# Altium schematic sheet PROTOTYPE_G431_4IN1_v1.0.SCHDOC: Exuav BLS 32BIT ESC
size 660 x 393 mm
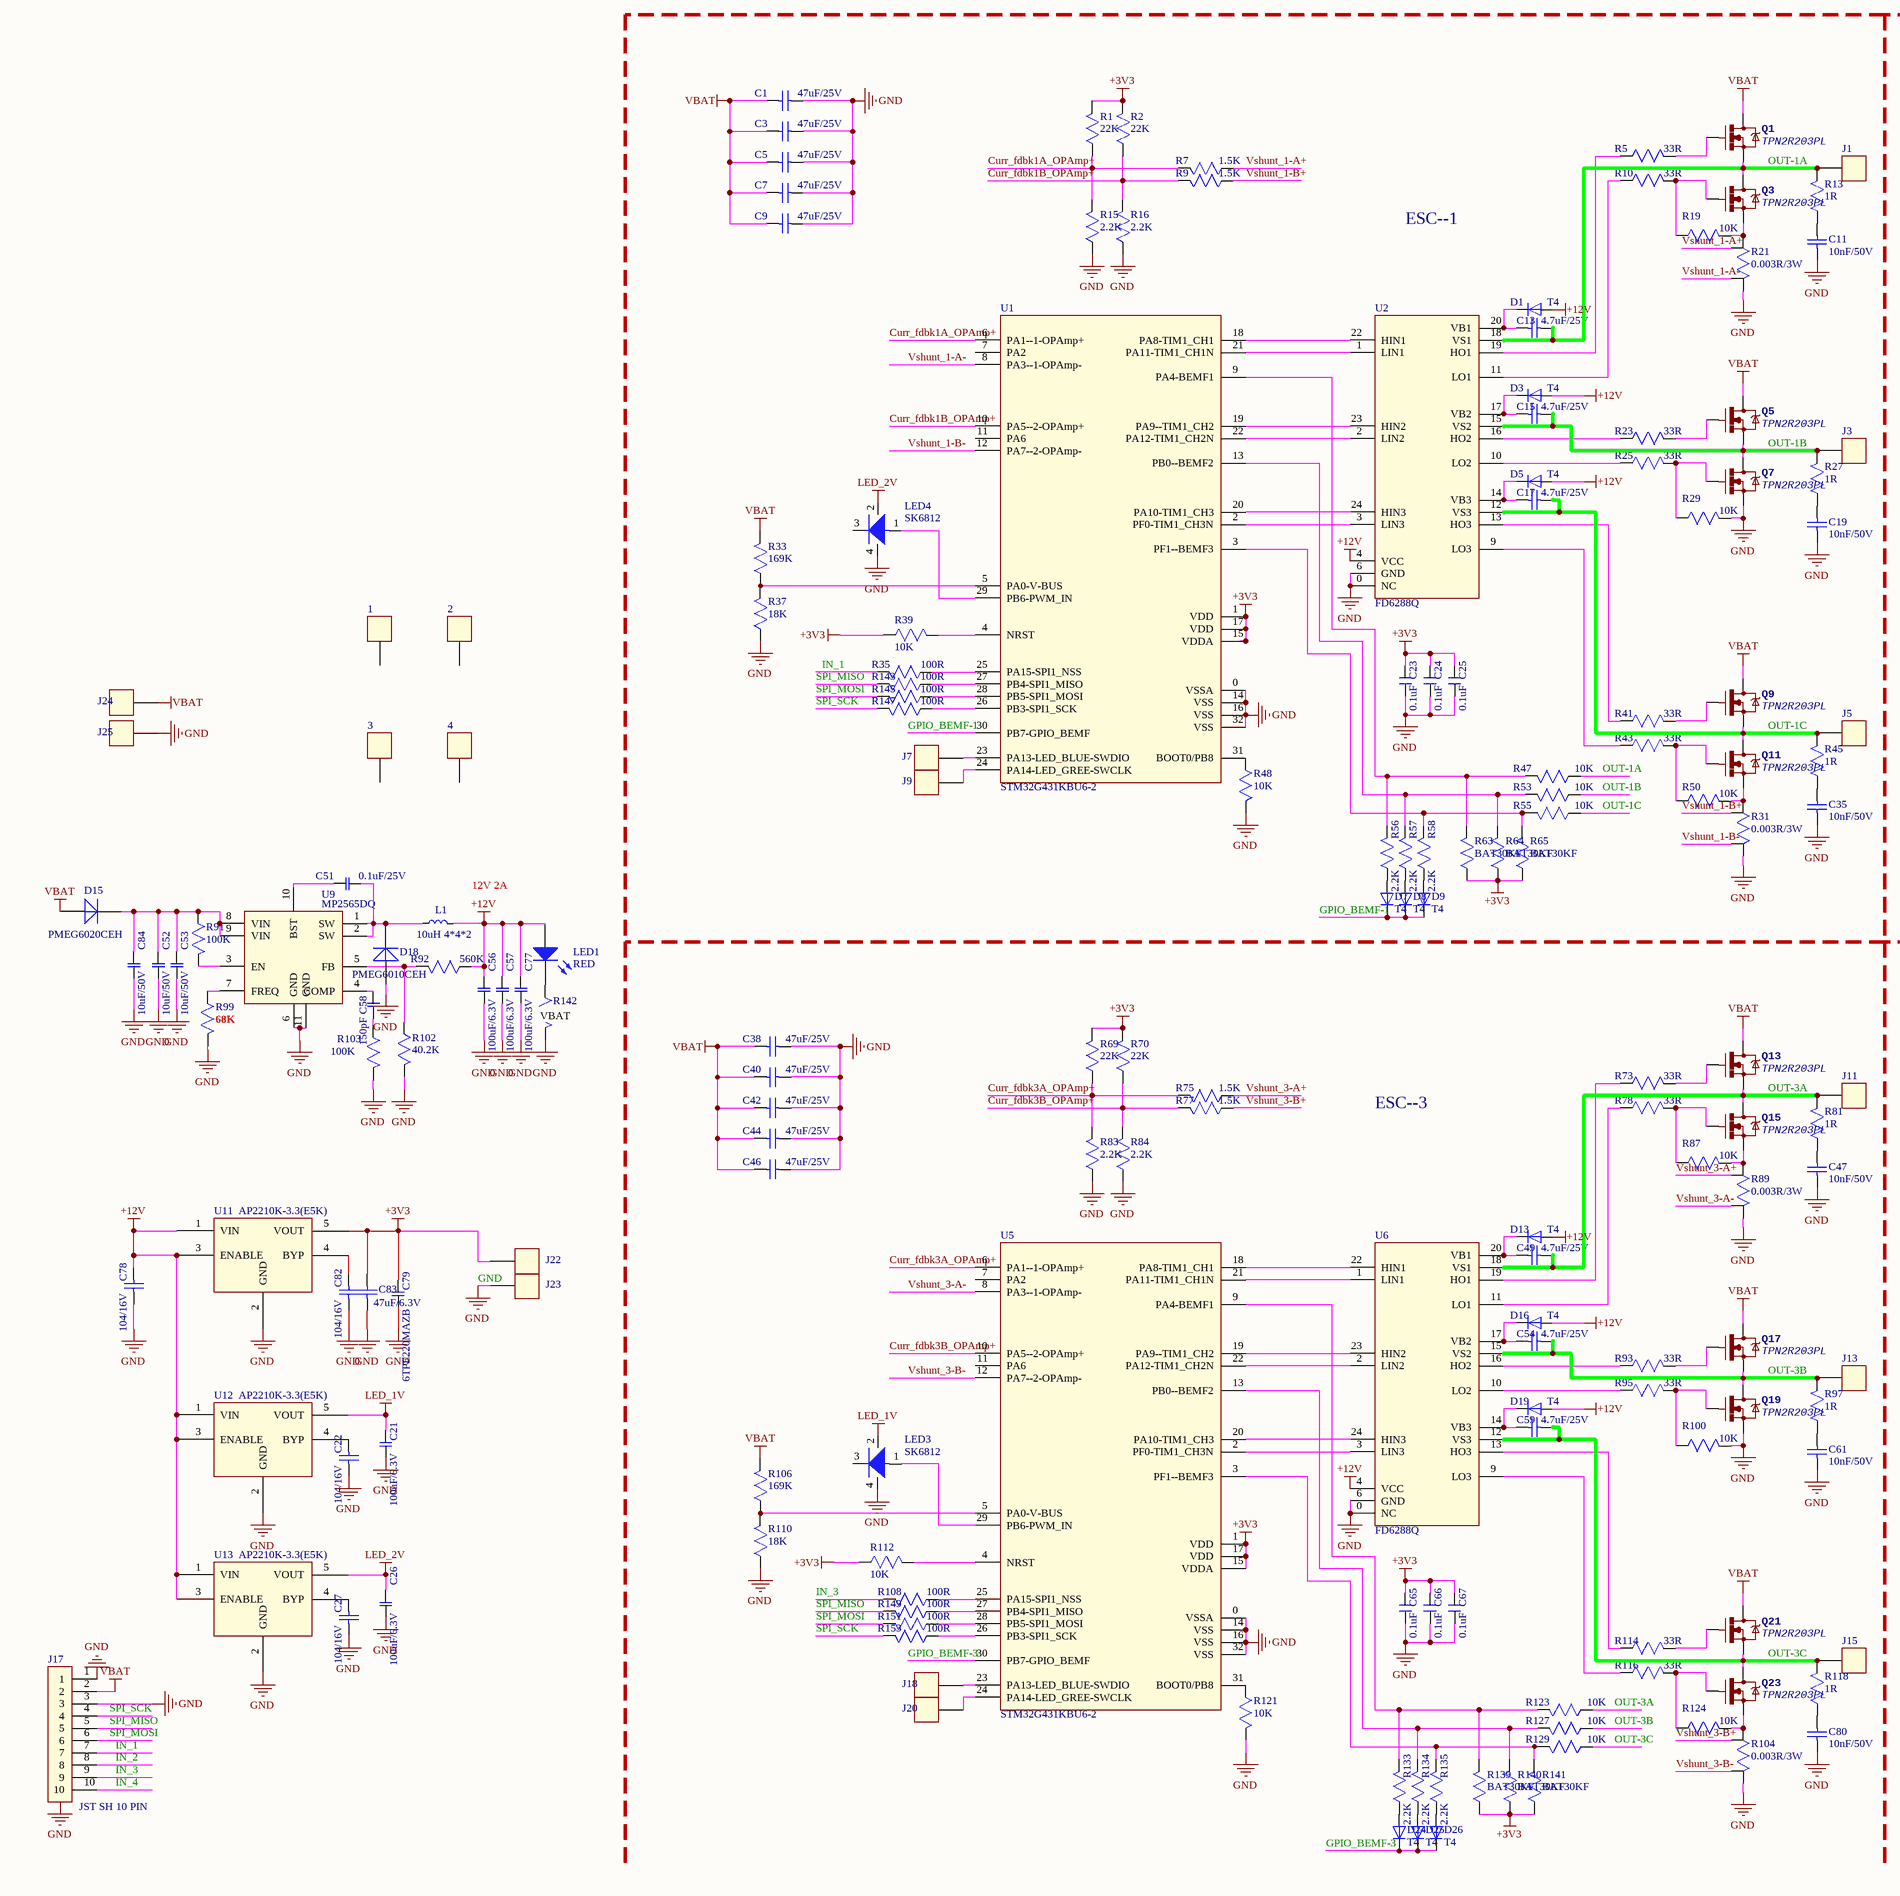
[diagram p0: PROTOTYPE_G431_4IN1_v1.0.SCHDOC, left]
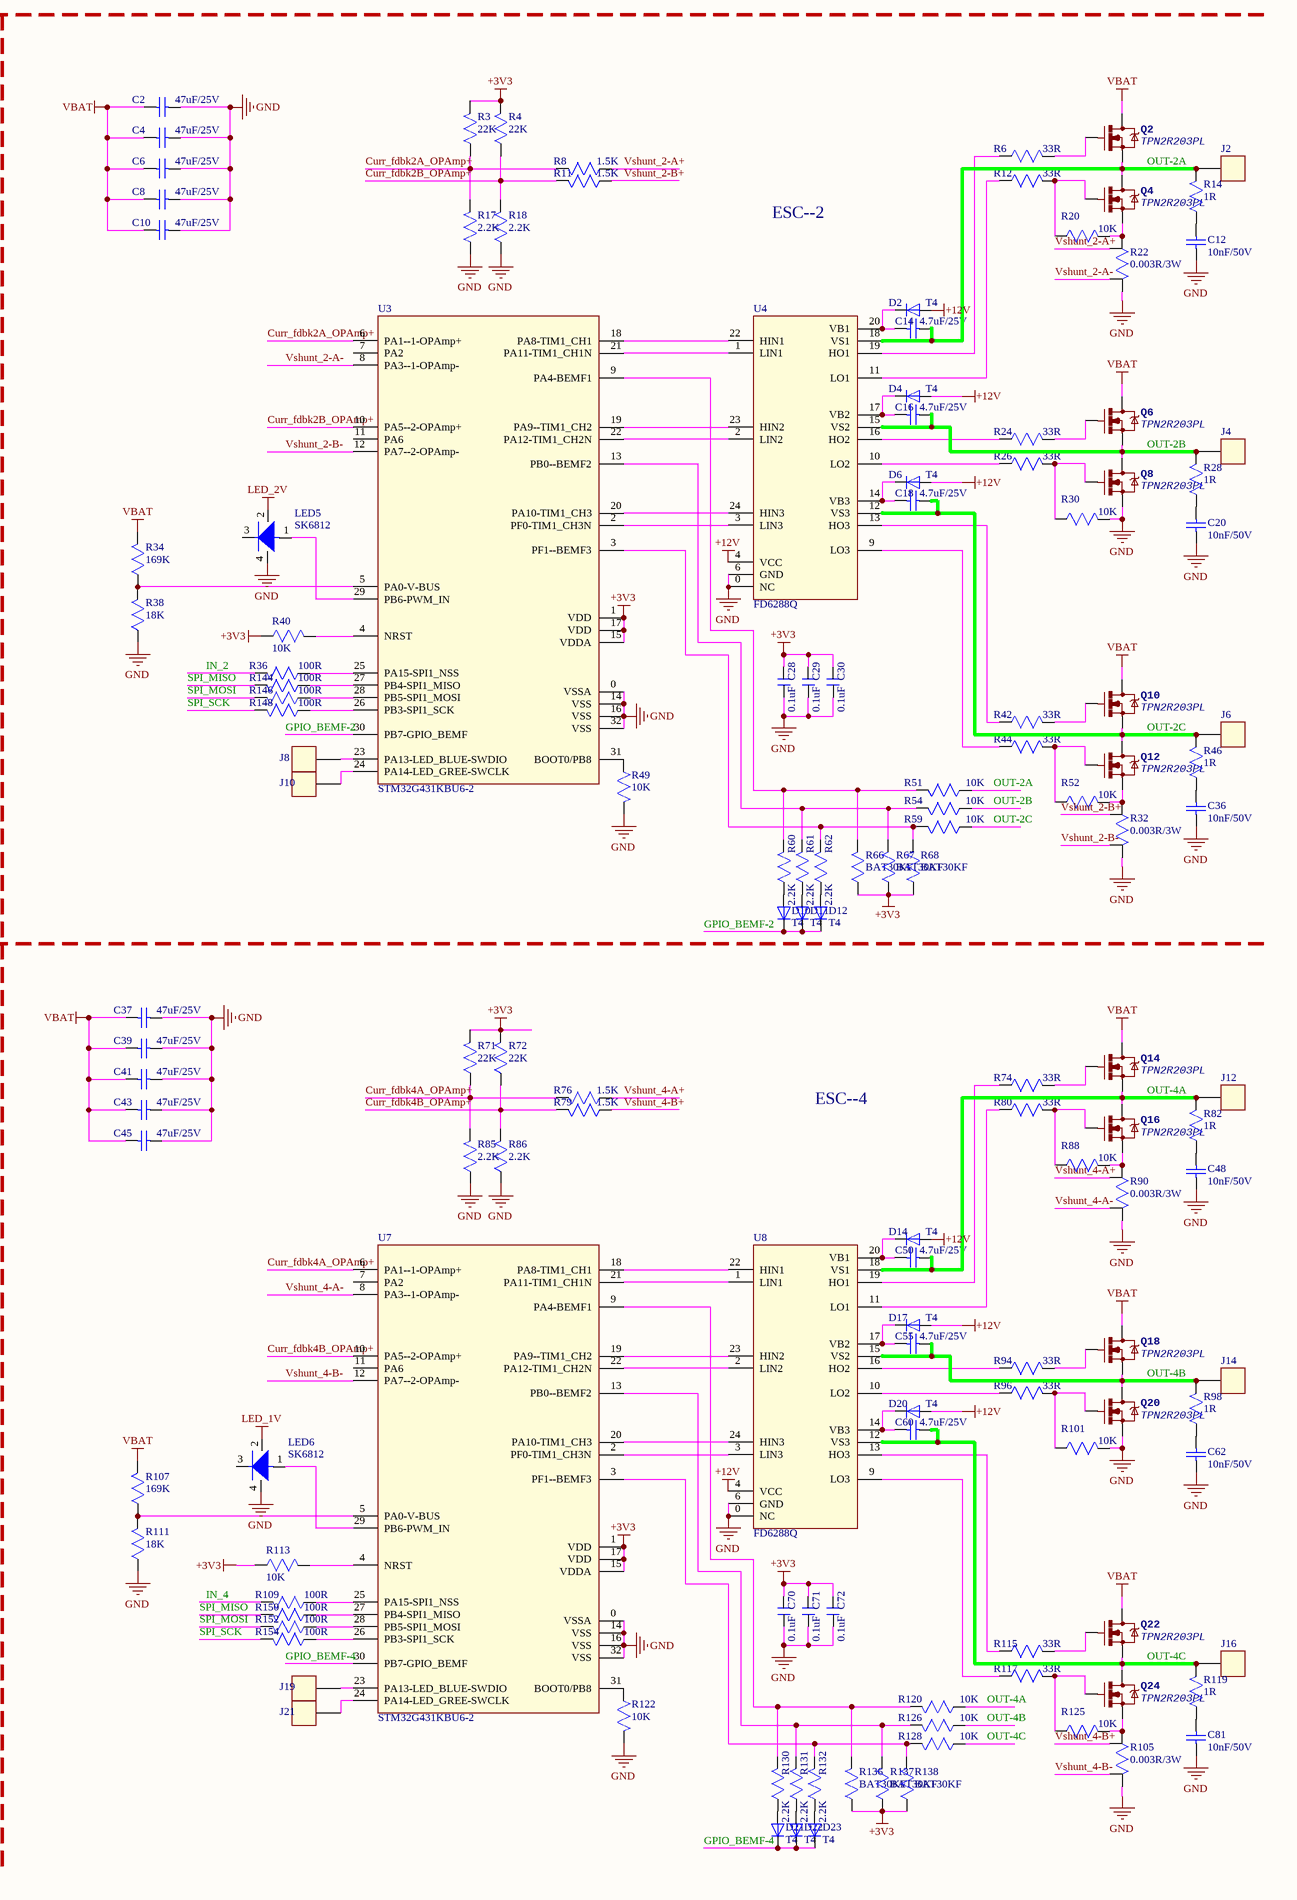
[diagram p1: PROTOTYPE_G431_4IN1_v1.0.SCHDOC, right]

## Parts
1  (no value)  [PAD-0.1]
2  (no value)  [PAD-0.1]
3  (no value)  [PAD-0.1]
4  (no value)  [PAD-0.1]
C1  47uF/25V  [1206-RES]
C2  47uF/25V  [1206-RES]
C3  47uF/25V  [1206-RES]
C4  47uF/25V  [1206-RES]
C5  47uF/25V  [1206-RES]
C6  47uF/25V  [1206-RES]
C7  47uF/25V  [1206-RES]
C8  47uF/25V  [1206-RES]
C9  47uF/25V  [1206-RES]
C10  47uF/25V  [1206-RES]
C11  10nF/50V  [0402-RES]
C12  10nF/50V  [0402-RES]
C13  4.7uF/25V  [0603-RES]
C14  4.7uF/25V  [0603-RES]
C15  4.7uF/25V  [0603-RES]
C16  4.7uF/25V  [0603-RES]
C17  4.7uF/25V  [0603-RES]
C18  4.7uF/25V  [0603-RES]
C19  10nF/50V  [0402-RES]
C20  10nF/50V  [0402-RES]
C21  100uF/6.3V  [1206-RES]
C22  104/16V  [0402-RES]
C23  0.1uF  [0402-RES]
C24  0.1uF  [0402-RES]
C25  0.1uF  [0402-RES]
C26  100uF/6.3V  [1206-RES]
C27  104/16V  [0402-RES]
C28  0.1uF  [0402-RES]
C29  0.1uF  [0402-RES]
C30  0.1uF  [0402-RES]
C35  10nF/50V  [0402-RES]
C36  10nF/50V  [0402-RES]
C37  47uF/25V  [1206-RES]
C38  47uF/25V  [1206-RES]
C39  47uF/25V  [1206-RES]
C40  47uF/25V  [1206-RES]
C41  47uF/25V  [1206-RES]
C42  47uF/25V  [1206-RES]
C43  47uF/25V  [1206-RES]
C44  47uF/25V  [1206-RES]
C45  47uF/25V  [1206-RES]
C46  47uF/25V  [1206-RES]
C47  10nF/50V  [0402-RES]
C48  10nF/50V  [0402-RES]
C49  4.7uF/25V  [0603-RES]
C50  4.7uF/25V  [0603-RES]
C51  0.1uF/25V  [0402-RES]
C52  10uF/50V  [1206-RES]
C53  10uF/50V  [1206-RES]
C54  4.7uF/25V  [0603-RES]
C55  4.7uF/25V  [0603-RES]
C56  100uF/6.3V  [1206-RES]
C57  100uF/6.3V  [1206-RES]
C58  150pF  [0402-RES]
C59  4.7uF/25V  [0603-RES]
C60  4.7uF/25V  [0603-RES]
C61  10nF/50V  [0402-RES]
C62  10nF/50V  [0402-RES]
C65  0.1uF  [0402-RES]
C66  0.1uF  [0402-RES]
C67  0.1uF  [0402-RES]
C70  0.1uF  [0402-RES]
C71  0.1uF  [0402-RES]
C72  0.1uF  [0402-RES]
C77  100uF/6.3V  [1206-RES]
C78  104/16V  [0402-RES]
C79  6TPE220MAZB  [3528-CAP]
C80  10nF/50V  [0402-RES]
C81  10nF/50V  [0402-RES]
C82  104/16V  [0402-RES]
C83  47uF/6.3V  [0805-RES]
C84  10uF/50V  [1206-RES]
D1  T4  [SOD523]
D2  T4  [SOD523]
D3  T4  [SOD523]
D4  T4  [SOD523]
D5  T4  [SOD523]
D6  T4  [SOD523]
D7  T4  [SOD-723]
D8  T4  [SOD-723]
D9  T4  [SOD-723]
D10  T4  [SOD-723]
D11  T4  [SOD-723]
D12  T4  [SOD-723]
D13  T4  [SOD523]
D14  T4  [SOD523]
D15  PMEG6020CEH  [SOD123W]
D16  T4  [SOD523]
D17  T4  [SOD523]
D18  PMEG6010CEH  [SOD123W]
D19  T4  [SOD523]
D20  T4  [SOD523]
D21  T4  [SOD-723]
D22  T4  [SOD-723]
D23  T4  [SOD-723]
D24  T4  [SOD-723]
D25  T4  [SOD-723]
D26  T4  [SOD-723]
J1  (no value)  [PAD-1  4*3]
J2  (no value)  [PAD-1  4*3]
J3  (no value)  [PAD-1  4*3]
J4  (no value)  [PAD-1  4*3]
J5  (no value)  [PAD-1  4*3]
J6  (no value)  [PAD-1  4*3]
J7  (no value)  [PAD-1  1*1.5]
J8  (no value)  [PAD-1  1*1.5]
J9  (no value)  [PAD-1  1*1.5]
J10  (no value)  [PAD-1  1*1.5]
J11  (no value)  [PAD-1  4*3]
J12  (no value)  [PAD-1  4*3]
J13  (no value)  [PAD-1  4*3]
J14  (no value)  [PAD-1  4*3]
J15  (no value)  [PAD-1  4*3]
J16  (no value)  [PAD-1  4*3]
J17  JST SH 10 PIN  [JST SH 10 PIN]
J18  (no value)  [PAD-1  1*1.5]
J19  (no value)  [PAD-1  1*1.5]
J20  (no value)  [PAD-1  1*1.5]
J21  (no value)  [PAD-1  1*1.5]
J22  (no value)  [PAD-1  1*1.5]
J23  (no value)  [PAD-1  1*1.5]
J24  (no value)  [PAD-1  1*1.5]
J25  (no value)  [PAD-1  1*1.5]
L1  10uH 4*4*2  [LPS4018]
LED1  RED  [0402-LED]
LED3  SK6812  [SK6812]
LED4  SK6812  [SK6812]
LED5  SK6812  [SK6812]
LED6  SK6812  [SK6812]
Q1  TPN2R203PL  [DFN8]
Q2  TPN2R203PL  [DFN8]
Q3  TPN2R203PL  [DFN8]
Q4  TPN2R203PL  [DFN8]
Q5  TPN2R203PL  [DFN8]
Q6  TPN2R203PL  [DFN8]
Q7  TPN2R203PL  [DFN8]
Q8  TPN2R203PL  [DFN8]
Q9  TPN2R203PL  [DFN8]
Q10  TPN2R203PL  [DFN8]
Q11  TPN2R203PL  [DFN8]
Q12  TPN2R203PL  [DFN8]
Q13  TPN2R203PL  [DFN8]
Q14  TPN2R203PL  [DFN8]
Q15  TPN2R203PL  [DFN8]
Q16  TPN2R203PL  [DFN8]
Q17  TPN2R203PL  [DFN8]
Q18  TPN2R203PL  [DFN8]
Q19  TPN2R203PL  [DFN8]
Q20  TPN2R203PL  [DFN8]
Q21  TPN2R203PL  [DFN8]
Q22  TPN2R203PL  [DFN8]
Q23  TPN2R203PL  [DFN8]
Q24  TPN2R203PL  [DFN8]
R1  22K  [0402-RES]
R2  22K  [0402-RES]
R3  22K  [0402-RES]
R4  22K  [0402-RES]
R5  33R  [0402-RES]
R6  33R  [0402-RES]
R7  1.5K  [0402-RES]
R8  1.5K  [0402-RES]
R9  1.5K  [0402-RES]
R10  33R  [0402-RES]
R11  1.5K  [0402-RES]
R12  33R  [0402-RES]
R13  1R  [0402-RES]
R14  1R  [0402-RES]
R15  2.2K  [0402-RES]
R16  2.2K  [0402-RES]
R17  2.2K  [0402-RES]
R18  2.2K  [0402-RES]
R19  10K  [0402-RES]
R20  10K  [0402-RES]
R21  0.003R/3W  [2010-RES]
R22  0.003R/3W  [2010-RES]
R23  33R  [0402-RES]
R24  33R  [0402-RES]
R25  33R  [0402-RES]
R26  33R  [0402-RES]
R27  1R  [0402-RES]
R28  1R  [0402-RES]
R29  10K  [0402-RES]
R30  10K  [0402-RES]
R31  0.003R/3W  [2010-RES]
R32  0.003R/3W  [2010-RES]
R33  169K  [0402-RES]
R34  169K  [0402-RES]
R35  100R  [0402-RES]
R36  100R  [0402-RES]
R37  18K  [0402-RES]
R38  18K  [0402-RES]
R39  10K  [0402-RES]
R40  10K  [0402-RES]
R41  33R  [0402-RES]
R42  33R  [0402-RES]
R43  33R  [0402-RES]
R44  33R  [0402-RES]
R45  1R  [0402-RES]
R46  1R  [0402-RES]
R47  10K  [0402-RES]
R48  10K  [0402-RES]
R49  10K  [0402-RES]
R50  10K  [0402-RES]
R51  10K  [0402-RES]
R52  10K  [0402-RES]
R53  10K  [0402-RES]
R54  10K  [0402-RES]
R55  10K  [0402-RES]
R56  2.2K  [0402-RES]
R57  2.2K  [0402-RES]
R58  2.2K  [0402-RES]
R59  10K  [0402-RES]
R60  2.2K  [0402-RES]
R61  2.2K  [0402-RES]
R62  2.2K  [0402-RES]
R63  BAT30KF  [0402-RES]
R64  BAT30KF  [0402-RES]
R65  BAT30KF  [0402-RES]
R66  BAT30KF  [0402-RES]
R67  BAT30KF  [0402-RES]
R68  BAT30KF  [0402-RES]
R69  22K  [0402-RES]
R70  22K  [0402-RES]
R71  22K  [0402-RES]
R72  22K  [0402-RES]
R73  33R  [0402-RES]
R74  33R  [0402-RES]
R75  1.5K  [0402-RES]
R76  1.5K  [0402-RES]
R77  1.5K  [0402-RES]
R78  33R  [0402-RES]
R79  1.5K  [0402-RES]
R80  33R  [0402-RES]
R81  1R  [0402-RES]
R82  1R  [0402-RES]
R83  2.2K  [0402-RES]
R84  2.2K  [0402-RES]
R85  2.2K  [0402-RES]
R86  2.2K  [0402-RES]
R87  10K  [0402-RES]
R88  10K  [0402-RES]
R89  0.003R/3W  [2010-RES]
R90  0.003R/3W  [2010-RES]
R91  100K  [0402-RES]
R92  560K  [0402-RES]
R93  33R  [0402-RES]
R94  33R  [0402-RES]
R95  33R  [0402-RES]
R96  33R  [0402-RES]
R97  1R  [0402-RES]
R98  1R  [0402-RES]
R99  68K  [0402-RES]
R100  10K  [0402-RES]
R101  10K  [0402-RES]
R102  40.2K  [0402-RES]
R103  100K  [0402-RES]
R104  0.003R/3W  [2010-RES]
R105  0.003R/3W  [2010-RES]
R106  169K  [0402-RES]
R107  169K  [0402-RES]
R108  100R  [0402-RES]
R109  100R  [0402-RES]
R110  18K  [0402-RES]
R111  18K  [0402-RES]
R112  10K  [0402-RES]
R113  10K  [0402-RES]
R114  33R  [0402-RES]
R115  33R  [0402-RES]
R116  33R  [0402-RES]
R117  33R  [0402-RES]
R118  1R  [0402-RES]
R119  1R  [0402-RES]
R120  10K  [0402-RES]
R121  10K  [0402-RES]
R122  10K  [0402-RES]
R123  10K  [0402-RES]
R124  10K  [0402-RES]
R125  10K  [0402-RES]
R126  10K  [0402-RES]
R127  10K  [0402-RES]
R128  10K  [0402-RES]
R129  10K  [0402-RES]
R130  2.2K  [0402-RES]
R131  2.2K  [0402-RES]
R132  2.2K  [0402-RES]
R133  2.2K  [0402-RES]
R134  2.2K  [0402-RES]
R135  2.2K  [0402-RES]
R136  BAT30KF  [0402-RES]
R137  BAT30KF  [0402-RES]
R138  BAT30KF  [0402-RES]
R139  BAT30KF  [0402-RES]
R140  BAT30KF  [0402-RES]
R141  BAT30KF  [0402-RES]
R142  1K  [0402-RES]
R143  100R  [0402-RES]
R144  100R  [0402-RES]
R145  100R  [0402-RES]
R146  100R  [0402-RES]
R147  100R  [0402-RES]
R148  100R  [0402-RES]
R149  100R  [0402-RES]
R150  100R  [0402-RES]
R151  100R  [0402-RES]
R152  100R  [0402-RES]
R153  100R  [0402-RES]
R154  100R  [0402-RES]
U1  STM32G431KBU6-2  [UFQFPN32]
U2  FD6288Q  [QFN24]
U3  STM32G431KBU6-2  [UFQFPN32]
U4  FD6288Q  [QFN24]
U5  STM32G431KBU6-2  [UFQFPN32]
U6  FD6288Q  [QFN24]
U7  STM32G431KBU6-2  [UFQFPN32]
U8  FD6288Q  [QFN24]
U9  MP2565DQ  [QFN10]
U11  AP2210K-3.3(E5K)  [SOT23-5]
U12  AP2210K-3.3(E5K)  [SOT23-5]
U13  AP2210K-3.3(E5K)  [SOT23-5]

## Nets
+3V3: C23.2 C24.2 C25.2 C28.2 C29.2 C30.2 C65.2 C66.2 C67.2 C70.2 C71.2 C72.2 C79.1 C83.2 J22.1 R1.2 R2.2 R3.2 R4.2 R39.1 R40.1 R63.1 R64.1 R65.1 R66.1 R67.1 R68.1 R69.2 R70.2 R71.2 R72.2 R112.1 R113.1 R136.1 R137.1 R138.1 R139.1 R140.1 R141.1 U1.1(VDD) U1.15(VDDA) U1.17(VDD) U3.1(VDD) U3.15(VDDA) U3.17(VDD) U5.1(VDD) U5.15(VDDA) U5.17(VDD) U7.1(VDD) U7.15(VDDA) U7.17(VDD) U11.5(VOUT)
+12V: C56.1 C57.1 C77.1 C78.2 D1.2 D2.2 D3.2 D4.2 D5.2 D6.2 D13.2 D14.2 D16.2 D17.2 D19.2 D20.2 L1.1 LED1.1 R92.1 U2.4(VCC) U4.4(VCC) U6.4(VCC) U8.4(VCC) U11.1(VIN) U11.3(ENABLE) U12.1(VIN) U12.3(ENABLE) U13.1(VIN) U13.3(ENABLE)
GND: C1.2 C2.2 C3.2 C4.2 C5.2 C6.2 C7.2 C8.2 C9.2 C10.2 C11.2 C12.2 C19.2 C20.2 C21.2 C22.1 C23.1 C24.1 C25.1 C26.2 C27.1 C28.1 C29.1 C30.1 C35.2 C36.2 C37.2 C38.2 C39.2 C40.2 C41.2 C42.2 C43.2 C44.2 C45.2 C46.2 C47.2 C48.2 C52.2 C53.2 C56.2 C57.2 C61.2 C62.2 C65.1 C66.1 C67.1 C70.1 C71.1 C72.1 C77.2 C78.1 C79.2 C80.2 C81.2 C82.1 C83.1 C84.2 D18.2(CATHODE) J17.0(GND) J17.1 J17.3 J23.1 J25.1 LED3.4(GND) LED4.4(GND) LED5.4(GND) LED6.4(GND) Q7.3(S) Q8.3(S) Q19.3(S) Q20.3(S) R15.1 R16.1 R17.1 R18.1 R21.2 R22.2 R29.2 R30.2 R31.2 R32.2 R37.1 R38.1 R48.2 R49.2 R83.1 R84.1 R85.1 R86.1 R89.2 R90.2 R99.2 R100.2 R101.2 R102.2 R103.2 R104.2 R105.2 R110.1 R111.1 R121.2 R122.2 R142.2 U1.0(VSSA) U1.14(VSS) U1.16(VSS) U1.32(VSS) U2.0(NC) U2.6(GND) U3.0(VSSA) U3.14(VSS) U3.16(VSS) U3.32(VSS) U4.0(NC) U4.6(GND) U5.0(VSSA) U5.14(VSS) U5.16(VSS) U5.32(VSS) U6.0(NC) U6.6(GND) U7.0(VSSA) U7.14(VSS) U7.16(VSS) U7.32(VSS) U8.0(NC) U8.6(GND) U9.6(GND) U9.11(GND) U11.2(GND) U12.2(GND) U13.2(GND)
LED_1V: C21.1 LED3.2(VDD) LED6.2(VDD) U12.5(VOUT)
LED_2V: C26.1 LED4.2(VDD) LED5.2(VDD) U13.5(VOUT)
VBAT: C1.1 C2.1 C3.1 C4.1 C5.1 C6.1 C7.1 C8.1 C9.1 C10.1 C37.1 C38.1 C39.1 C40.1 C41.1 C42.1 C43.1 C44.1 C45.1 C46.1 D15.2(CATHODE) J17.2 J24.1 Q1.5(D) Q2.5(D) Q5.5(D) Q6.5(D) Q9.5(D) Q10.5(D) Q13.5(D) Q14.5(D) Q17.5(D) Q18.5(D) Q21.5(D) Q22.5(D) R33.2 R34.2 R106.2 R107.2
Curr_fdbk1A_OPAmp+: R1.1 R7.2 R15.2 U1.6(PA1--1-OPAmp+)
Curr_fdbk1B_OPAmp+: R2.1 R9.2 R16.2 U1.10(PA5--2-OPAmp+)
Curr_fdbk2A_OPAmp+: R3.1 R8.2 R17.2 U3.6(PA1--1-OPAmp+)
Curr_fdbk2B_OPAmp+: R4.1 R11.2 R18.2 U3.10(PA5--2-OPAmp+)
Curr_fdbk3A_OPAmp+: R69.1 R75.2 R83.2 U5.6(PA1--1-OPAmp+)
Curr_fdbk3B_OPAmp+: R70.1 R77.2 R84.2 U5.10(PA5--2-OPAmp+)
Curr_fdbk4A_OPAmp+: R71.1 R76.2 R85.2 U7.6(PA1--1-OPAmp+)
Curr_fdbk4B_OPAmp+: R72.1 R79.2 R86.2 U7.10(PA5--2-OPAmp+)
GPIO_BEMF-1: D7.1 D8.1 D9.1 U1.30(PB7-GPIO_BEMF)
GPIO_BEMF-2: D10.1 D11.1 D12.1 U3.30(PB7-GPIO_BEMF)
GPIO_BEMF-3: D24.1 D25.1 D26.1 U5.30(PB7-GPIO_BEMF)
GPIO_BEMF-4: D21.1 D22.1 D23.1 U7.30(PB7-GPIO_BEMF)
IN_1: J17.7 R35.2
IN_2: J17.8 R36.2
IN_3: J17.9 R108.2
IN_4: J17.10 R109.2
OUT-1A: C13.1 J1.1 Q1.3(S) Q3.5(D) R13.2 R47.1 U2.18(VS1)
OUT-1B: C15.1 J3.1 Q5.3(S) Q7.5(D) R27.2 R53.1 U2.15(VS2)
OUT-1C: C17.1 J5.1 Q9.3(S) Q11.5(D) R45.2 R55.1 U2.12(VS3)
OUT-2A: C14.1 J2.1 Q2.3(S) Q4.5(D) R14.2 R51.1 U4.18(VS1)
OUT-2B: C16.1 J4.1 Q6.3(S) Q8.5(D) R28.2 R54.1 U4.15(VS2)
OUT-2C: C18.1 J6.1 Q10.3(S) Q12.5(D) R46.2 R59.1 U4.12(VS3)
OUT-3A: C49.1 J11.1 Q13.3(S) Q15.5(D) R81.2 R123.1 U6.18(VS1)
OUT-3B: C54.1 J13.1 Q17.3(S) Q19.5(D) R97.2 R127.1 U6.15(VS2)
OUT-3C: C59.1 J15.1 Q21.3(S) Q23.5(D) R118.2 R129.1 U6.12(VS3)
OUT-4A: C50.1 J12.1 Q14.3(S) Q16.5(D) R82.2 R120.1 U8.18(VS1)
OUT-4B: C55.1 J14.1 Q18.3(S) Q20.5(D) R98.2 R126.1 U8.15(VS2)
OUT-4C: C60.1 J16.1 Q22.3(S) Q24.5(D) R119.2 R128.1 U8.12(VS3)
SPI_MISO: J17.5 R143.2 R144.2 R149.2 R150.2
SPI_MOSI: J17.6 R145.2 R146.2 R151.2 R152.2
SPI_SCK: J17.4 R147.2 R148.2 R153.2 R154.2
Vshunt_1-A+: R7.1 R21.3
Vshunt_1-A-: R21.4 U1.8(PA3--1-OPAmp-)
Vshunt_1-B+: R9.1 R31.3
Vshunt_1-B-: R31.4 U1.12(PA7--2-OPAmp-)
Vshunt_2-A+: R8.1 R22.3
Vshunt_2-A-: R22.4 U3.8(PA3--1-OPAmp-)
Vshunt_2-B+: R11.1 R32.3
Vshunt_2-B-: R32.4 U3.12(PA7--2-OPAmp-)
Vshunt_3-A+: R75.1 R89.3
Vshunt_3-A-: R89.4 U5.8(PA3--1-OPAmp-)
Vshunt_3-B+: R77.1 R104.3
Vshunt_3-B-: R104.4 U5.12(PA7--2-OPAmp-)
Vshunt_4-A+: R76.1 R90.3
Vshunt_4-A-: R90.4 U7.8(PA3--1-OPAmp-)
Vshunt_4-B+: R79.1 R105.3
Vshunt_4-B-: R105.4 U7.12(PA7--2-OPAmp-)
NetC11_1: C11.1 R13.1
NetC12_1: C12.1 R14.1
NetC13_2: C13.2 D1.1 U2.20(VB1)
NetC14_2: C14.2 D2.1 U4.20(VB1)
NetC15_2: C15.2 D3.1 U2.17(VB2)
NetC16_2: C16.2 D4.1 U4.17(VB2)
NetC17_2: C17.2 D5.1 U2.14(VB3)
NetC18_2: C18.2 D6.1 U4.14(VB3)
NetC19_1: C19.1 R27.1
NetC20_1: C20.1 R28.1
NetC22_2: C22.2 U12.4(BYP)
NetC27_2: C27.2 U13.4(BYP)
NetC35_1: C35.1 R45.1
NetC36_1: C36.1 R46.1
NetC47_1: C47.1 R81.1
NetC48_1: C48.1 R82.1
NetC49_2: C49.2 D13.1 U6.20(VB1)
NetC50_2: C50.2 D14.1 U8.20(VB1)
NetC51_1: C51.1 D18.1(ANODE) L1.2 U9.1(SW) U9.2(SW)
NetC51_2: C51.2 U9.10(BST)
NetC52_1: C52.1 C53.1 C84.1 D15.1(ANODE) R91.1 U9.8(VIN) U9.9(VIN)
NetC54_2: C54.2 D16.1 U6.17(VB2)
NetC55_2: C55.2 D17.1 U8.17(VB2)
NetC58_1: C58.1 R103.1
NetC58_2: C58.2 U9.4(COMP)
NetC59_2: C59.2 D19.1 U6.14(VB3)
NetC60_2: C60.2 D20.1 U8.14(VB3)
NetC61_1: C61.1 R97.1
NetC62_1: C62.1 R98.1
NetC80_1: C80.1 R118.1
NetC81_1: C81.1 R119.1
NetC82_2: C82.2 U11.4(BYP)
NetD7_2: D7.2 R56.1
NetD8_2: D8.2 R57.1
NetD9_2: D9.2 R58.1
NetD10_2: D10.2 R60.1
NetD11_2: D11.2 R61.1
NetD12_2: D12.2 R62.1
NetD21_2: D21.2 R130.1
NetD22_2: D22.2 R131.1
NetD23_2: D23.2 R132.1
NetD24_2: D24.2 R133.1
NetD25_2: D25.2 R134.1
NetD26_2: D26.2 R135.1
NetJ7_1: J7.1 U1.23(PA13-LED_BLUE-SWDIO)
NetJ8_1: J8.1 U3.23(PA13-LED_BLUE-SWDIO)
NetJ9_1: J9.1 U1.24(PA14-LED_GREE-SWCLK)
NetJ10_1: J10.1 U3.24(PA14-LED_GREE-SWCLK)
NetJ18_1: J18.1 U5.23(PA13-LED_BLUE-SWDIO)
NetJ19_1: J19.1 U7.23(PA13-LED_BLUE-SWDIO)
NetJ20_1: J20.1 U5.24(PA14-LED_GREE-SWCLK)
NetJ21_1: J21.1 U7.24(PA14-LED_GREE-SWCLK)
NetLED1_2: LED1.2 R142.1
NetLED3_1: LED3.1(DIN) U5.29(PB6-PWM_IN)
NetLED4_1: LED4.1(DIN) U1.29(PB6-PWM_IN)
NetLED5_1: LED5.1(DIN) U3.29(PB6-PWM_IN)
NetLED6_1: LED6.1(DIN) U7.29(PB6-PWM_IN)
NetQ1_4: Q1.4(G) R5.2
NetQ2_4: Q2.4(G) R6.2
NetQ3_3: Q3.3(S) R19.2 R21.1
NetQ3_4: Q3.4(G) R10.2 R19.1
NetQ4_3: Q4.3(S) R20.2 R22.1
NetQ4_4: Q4.4(G) R12.2 R20.1
NetQ5_4: Q5.4(G) R23.2
NetQ6_4: Q6.4(G) R24.2
NetQ7_4: Q7.4(G) R25.2 R29.1
NetQ8_4: Q8.4(G) R26.2 R30.1
NetQ9_4: Q9.4(G) R41.2
NetQ10_4: Q10.4(G) R42.2
NetQ11_3: Q11.3(S) R31.1 R50.2
NetQ11_4: Q11.4(G) R43.2 R50.1
NetQ12_3: Q12.3(S) R32.1 R52.2
NetQ12_4: Q12.4(G) R44.2 R52.1
NetQ13_4: Q13.4(G) R73.2
NetQ14_4: Q14.4(G) R74.2
NetQ15_3: Q15.3(S) R87.2 R89.1
NetQ15_4: Q15.4(G) R78.2 R87.1
NetQ16_3: Q16.3(S) R88.2 R90.1
NetQ16_4: Q16.4(G) R80.2 R88.1
NetQ17_4: Q17.4(G) R93.2
NetQ18_4: Q18.4(G) R94.2
NetQ19_4: Q19.4(G) R95.2 R100.1
NetQ20_4: Q20.4(G) R96.2 R101.1
NetQ21_4: Q21.4(G) R114.2
NetQ22_4: Q22.4(G) R115.2
NetQ23_3: Q23.3(S) R104.1 R124.2
NetQ23_4: Q23.4(G) R116.2 R124.1
NetQ24_3: Q24.3(S) R105.1 R125.2
NetQ24_4: Q24.4(G) R117.2 R125.1
NetR5_1: R5.1 U2.19(HO1)
NetR6_1: R6.1 U4.19(HO1)
NetR10_1: R10.1 U2.11(LO1)
NetR12_1: R12.1 U4.11(LO1)
NetR23_1: R23.1 U2.16(HO2)
NetR24_1: R24.1 U4.16(HO2)
NetR25_1: R25.1 U2.10(LO2)
NetR26_1: R26.1 U4.10(LO2)
NetR33_1: R33.1 R37.2 U1.5(PA0-V-BUS)
NetR34_1: R34.1 R38.2 U3.5(PA0-V-BUS)
NetR35_1: R35.1 U1.25(PA15-SPI1_NSS)
NetR36_1: R36.1 U3.25(PA15-SPI1_NSS)
NetR39_2: R39.2 U1.4(NRST)
NetR40_2: R40.2 U3.4(NRST)
NetR41_1: R41.1 U2.13(HO3)
NetR42_1: R42.1 U4.13(HO3)
NetR43_1: R43.1 U2.9(LO3)
NetR44_1: R44.1 U4.9(LO3)
NetR47_2: R47.2 R56.2 R63.2 U1.9(PA4-BEMF1)
NetR48_1: R48.1 U1.31(BOOT0/PB8)
NetR49_1: R49.1 U3.31(BOOT0/PB8)
NetR51_2: R51.2 R60.2 R66.2 U3.9(PA4-BEMF1)
NetR53_2: R53.2 R57.2 R64.2 U1.13(PB0--BEMF2)
NetR54_2: R54.2 R61.2 R67.2 U3.13(PB0--BEMF2)
NetR55_2: R55.2 R58.2 R65.2 U1.3(PF1--BEMF3)
NetR59_2: R59.2 R62.2 R68.2 U3.3(PF1--BEMF3)
NetR73_1: R73.1 U6.19(HO1)
NetR74_1: R74.1 U8.19(HO1)
NetR78_1: R78.1 U6.11(LO1)
NetR80_1: R80.1 U8.11(LO1)
NetR91_2: R91.2 U9.3(EN)
NetR92_2: R92.2 R102.1 U9.5(FB)
NetR93_1: R93.1 U6.16(HO2)
NetR94_1: R94.1 U8.16(HO2)
NetR95_1: R95.1 U6.10(LO2)
NetR96_1: R96.1 U8.10(LO2)
NetR99_1: R99.1 U9.7(FREQ)
NetR106_1: R106.1 R110.2 U5.5(PA0-V-BUS)
NetR107_1: R107.1 R111.2 U7.5(PA0-V-BUS)
NetR108_1: R108.1 U5.25(PA15-SPI1_NSS)
NetR109_1: R109.1 U7.25(PA15-SPI1_NSS)
NetR112_2: R112.2 U5.4(NRST)
NetR113_2: R113.2 U7.4(NRST)
NetR114_1: R114.1 U6.13(HO3)
NetR115_1: R115.1 U8.13(HO3)
NetR116_1: R116.1 U6.9(LO3)
NetR117_1: R117.1 U8.9(LO3)
NetR120_2: R120.2 R130.2 R136.2 U7.9(PA4-BEMF1)
NetR121_1: R121.1 U5.31(BOOT0/PB8)
NetR122_1: R122.1 U7.31(BOOT0/PB8)
NetR123_2: R123.2 R133.2 R139.2 U5.9(PA4-BEMF1)
NetR126_2: R126.2 R131.2 R137.2 U7.13(PB0--BEMF2)
NetR127_2: R127.2 R134.2 R140.2 U5.13(PB0--BEMF2)
NetR128_2: R128.2 R132.2 R138.2 U7.3(PF1--BEMF3)
NetR129_2: R129.2 R135.2 R141.2 U5.3(PF1--BEMF3)
NetR143_1: R143.1 U1.27(PB4-SPI1_MISO)
NetR144_1: R144.1 U3.27(PB4-SPI1_MISO)
NetR145_1: R145.1 U1.28(PB5-SPI1_MOSI)
NetR146_1: R146.1 U3.28(PB5-SPI1_MOSI)
NetR147_1: R147.1 U1.26(PB3-SPI1_SCK)
NetR148_1: R148.1 U3.26(PB3-SPI1_SCK)
NetR149_1: R149.1 U5.27(PB4-SPI1_MISO)
NetR150_1: R150.1 U7.27(PB4-SPI1_MISO)
NetR151_1: R151.1 U5.28(PB5-SPI1_MOSI)
NetR152_1: R152.1 U7.28(PB5-SPI1_MOSI)
NetR153_1: R153.1 U5.26(PB3-SPI1_SCK)
NetR154_1: R154.1 U7.26(PB3-SPI1_SCK)
NetU1_2: U1.2(PF0-TIM1_CH3N) U2.3(LIN3)
NetU1_18: U1.18(PA8-TIM1_CH1) U2.22(HIN1)
NetU1_19: U1.19(PA9--TIM1_CH2) U2.23(HIN2)
NetU1_20: U1.20(PA10-TIM1_CH3) U2.24(HIN3)
NetU1_21: U1.21(PA11-TIM1_CH1N) U2.1(LIN1)
NetU1_22: U1.22(PA12-TIM1_CH2N) U2.2(LIN2)
NetU3_2: U3.2(PF0-TIM1_CH3N) U4.3(LIN3)
NetU3_18: U3.18(PA8-TIM1_CH1) U4.22(HIN1)
NetU3_19: U3.19(PA9--TIM1_CH2) U4.23(HIN2)
NetU3_20: U3.20(PA10-TIM1_CH3) U4.24(HIN3)
NetU3_21: U3.21(PA11-TIM1_CH1N) U4.1(LIN1)
NetU3_22: U3.22(PA12-TIM1_CH2N) U4.2(LIN2)
NetU5_2: U5.2(PF0-TIM1_CH3N) U6.3(LIN3)
NetU5_18: U5.18(PA8-TIM1_CH1) U6.22(HIN1)
NetU5_19: U5.19(PA9--TIM1_CH2) U6.23(HIN2)
NetU5_20: U5.20(PA10-TIM1_CH3) U6.24(HIN3)
NetU5_21: U5.21(PA11-TIM1_CH1N) U6.1(LIN1)
NetU5_22: U5.22(PA12-TIM1_CH2N) U6.2(LIN2)
NetU7_2: U7.2(PF0-TIM1_CH3N) U8.3(LIN3)
NetU7_18: U7.18(PA8-TIM1_CH1) U8.22(HIN1)
NetU7_19: U7.19(PA9--TIM1_CH2) U8.23(HIN2)
NetU7_20: U7.20(PA10-TIM1_CH3) U8.24(HIN3)
NetU7_21: U7.21(PA11-TIM1_CH1N) U8.1(LIN1)
NetU7_22: U7.22(PA12-TIM1_CH2N) U8.2(LIN2)

Not connected (* = marked no-connect by the designer): 1 1; 2 1; 3 1; 4 1; LED3 3(DO); LED4 3(DO); LED5 3(DO); LED6 3(DO); U1 7(PA2) 11(PA6); U3 7(PA2) 11(PA6); U5 7(PA2) 11(PA6); U7 7(PA2) 11(PA6)

## Notes on the sheet
- ESC--1
- ESC--2
- (near L1) 12V 2A
- (near R142) VBAT
- ESC--3
- ESC--4

## Library data of the parts
1-4 J1-J16 J18-J25 = PAD
C1-C10 C22 C27 C37-C46 C78 C82 C83 = Cap: Capacitor; Value: 22uF; Published: 8-Jun-2000; LatestRevisionDate: 17-Jul-2002; LatestRevisionNote: Re-released for DXP Platform.; PackageReference: RAD-0.3; Publisher: Altium Limited; PackageDescription: Radial Cap, Thru-Hole; 2 Leads; 0.3 in Pin Spacing
C11-C20 C35 C36 C47-C50 C54 C55 C59-C62 C80 C81 = Cap: Value: 22uF; Published: 8-Jun-2000; LatestRevisionDate: 17-Jul-2002; LatestRevisionNote: Re-released for DXP Platform.; PackageReference: RAD-0.3; Publisher: Altium Limited; PackageDescription: Radial Cap, Thru-Hole; 2 Leads; 0.3 in Pin Spacing
C21 C26 C51-C53 C56-C58 C77 C79 C84 = C
C23-C25 C28-C30 C65-C67 C70-C72 = CAP
D1-D26 = DIODE
J17 = J_10P
L1 = L
LED1 = LED1: Published: 8-Jun-2000; LatestRevisionDate: 08-Jul-2005; LatestRevisionNote: Mech Layer 1 removed.; PackageReference: LED-1; Publisher: Altium Limited
Q1-Q24 = AON7418
R1-R20 R23-R30 R33-R88 R91-R103 R106-R154 = R
R21 R22 R31 R32 R89 R90 R104 R105 = RES_4W
U2 U4 U6 U8 = FD6288Q-2
U9 = MP4460DQ/4462DQ
U11-U13 = MIC5207